# EAGLE schematic pmod-dual-bar-graph (EAGLE 7.4.0)
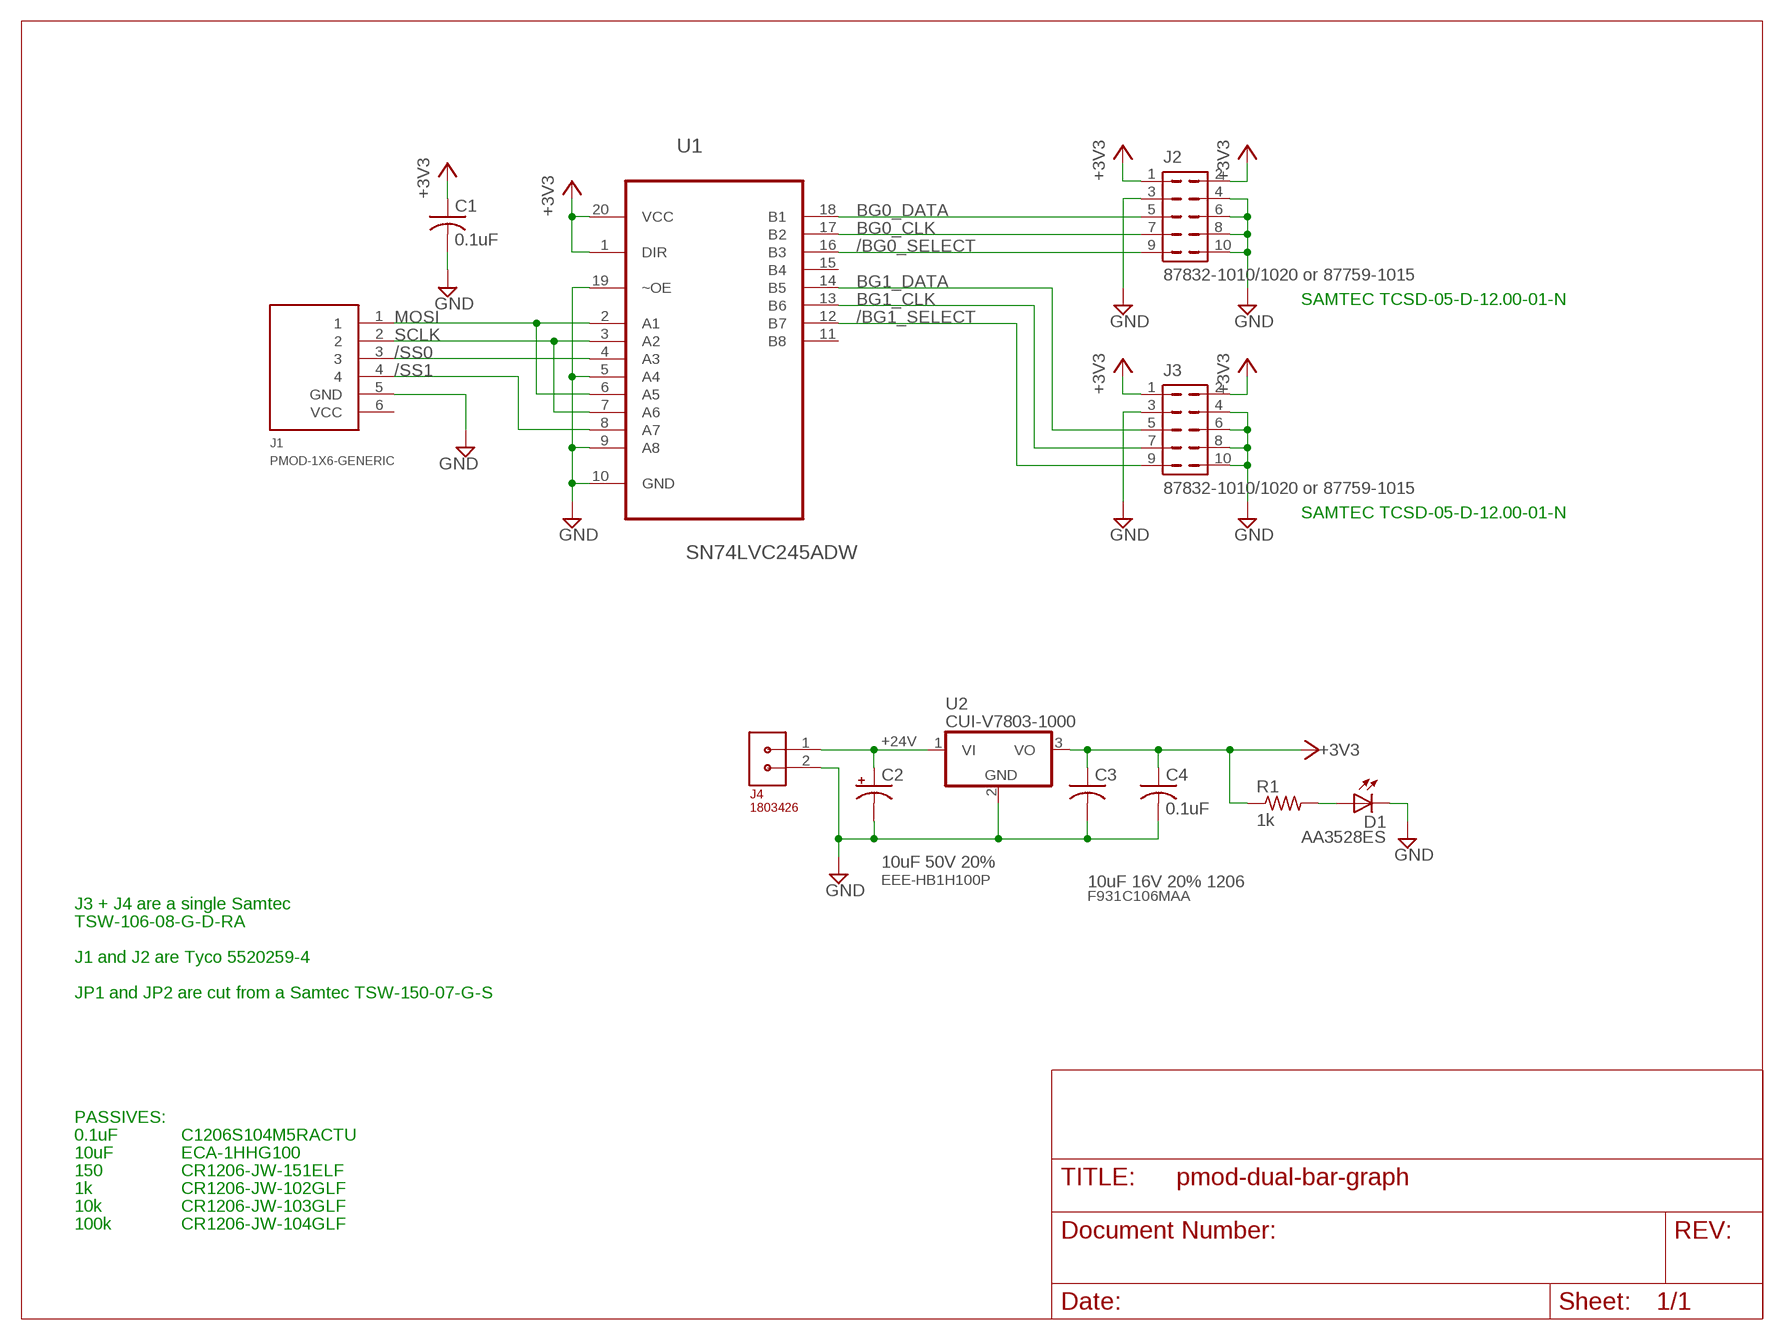
[diagram p0: schematic, sheet 1]

## Parts
C1  0.1uF  C-USC1206  [C1206]
C2  10uF 50V 20%  CPOL-USD  [PANASONIC_D]
C3  10uF 16V 20% 1206  C-USC1206  [C1206]
C4  0.1uF  C-USC1206  [C1206]
D1  AA3528ES  LEDKA-3528ASYC  [KA-3528ASYC]
J1  PMOD-1X6-GENERIC  [CON-PMOD-1X6]
J2  87832-1010/1020 or 87759-1015  87832-10  [87832-10]
J3  87832-1010/1020 or 87759-1015  87832-10  [87832-10]
J4  1803426  CON-3.81MM-1X2-PHOENIX-1803426  [CON-PHOENIX-1803426-3.81-1X2]
R1  1k  R-US_R1206  [R1206]
U1  SN74LVC245ADW  [SOIC127P1030X265-20N]
U2  CUI-V7803-1000  [CUI-78XX-1000]

## Nets
+3V3: C1.1 C3.1 C4.1 J2.1 J2.2 J3.1 J3.2 R1.1 U1.1(DIR) U1.20(VCC) U2.3(VO)
+24V: C2.+ J4.1 U2.1(VI)
/BG0_SELECT: J2.9 U1.16(B3)
/BG1_SELECT: J3.9 U1.12(B7)
/SS0: J1.3 U1.4(A3)
/SS1: J1.4 U1.8(A7)
BG0_CLK: J2.7 U1.17(B2)
BG0_DATA: J2.5 U1.18(B1)
BG1_CLK: J3.7 U1.13(B6)
BG1_DATA: J3.5 U1.14(B5)
GND: C1.2 C2.- C3.2 C4.2 D1.C J1.5(GND) J2.3 J2.4 J2.6 J2.8 J2.10 J3.3 J3.4 J3.6 J3.8 J3.10 J4.2 U1.5(A4) U1.9(A8) U1.10(GND) U1.19(~OE) U2.2(GND)
MOSI: J1.1 U1.2(A1) U1.6(A5)
N$31: D1.A R1.2
SCLK: J1.2 U1.3(A2) U1.7(A6)
Unconnected: J1.6(VCC) U1.11(B8) U1.15(B4)

## Notes on the sheet
- SAMTEC TCSD-05-D-12.00-01-N
- SAMTEC TCSD-05-D-12.00-01-N
- EEE-HB1H100P
- F931C106MAA
- J3 + J4 are a single Samtec
- TSW-106-08-G-D-RA
- J1 and J2 are Tyco 5520259-4
- JP1 and JP2 are cut from a Samtec TSW-150-07-G-S
- PASSIVES:
- 0.1uF | C1206S104M5RACTU
- 10uF | ECA-1HHG100
- 150 | CR1206-JW-151ELF
- 1k | CR1206-JW-102GLF
- 10k | CR1206-JW-103GLF
- 100k | CR1206-JW-104GLF

## Library data of the parts
C1 C3 C4 = rcl:C-US: CAPACITOR, American symbol
C2 = rcl:CPOL-US: POLARIZED CAPACITOR, American symbol
D1 = led:LED: LED OSRAM: - CHIPLED LG R971, LG N971, LY N971, LG Q971, LY Q971, LO R971, LY R971 LH N974, LH R974 LS Q976, LO Q976, LY Q976 LO Q996 - Hyper CHIPLED LW Q18S LB Q993, LB Q99A, LB R99A - SideLED LS A670, LO A670, LY A670, LG A670, LP A670 LB A673, LV A673, LT A673, LW A673 LH A674 LY A675 LS A676, LA A676, LO A676, LY A676, LW A676 LS A679, LY A679, LG A679 - Hyper Micro SIDELED® LS Y876, LA Y876, LO Y876, LY Y876 LT Y87S - SmartLED LW L88C, LW L88S LB L89C, LB L89S, LG L890 LS L89K, LO L89K, LY L89K LS L896, LA L896, LO L896, LY L896 - TOPLED LS T670, LO T670, LY T670, LG T670, LP T670 LSG T670, LSP T670, LSY T670, LOP T670, LYG T670 LG T671, LOG T671, LSG T671 LB T673, LV T673, LT T673, LW T673 LH T674 LS T676, LA T676, LO T676, LY T676, LB T676, LH T676, LSB T676, LW T676 LB T67C, LV T67C, LT T67C, LS T67K, LO T67K, LY T67K, LW E67C LS E67B, LA E67B, LO E67B, LY E67B, LB E67C, LV E67C, LT E67C LW T67C LS T679, LY T679, LG T679 LS T770, LO T770, LY T770, LG T770, LP T770 LB T773, LV T773, LT T773, LW T773 LH T774 LS E675, LA E675, LY E675, LS T675 LS T776, LA T776, LO T776, LY T776, LB T776 LHGB T686 LT T68C, LB T68C - Hyper Mini TOPLED® LB M676 - Mini TOPLED Santana® LG M470 LS M47K, LO M47K, LY M47K Source: http://www.osram.convergy.de LUXEON: - LUMILED® LXK2-PW12-R00, LXK2-PW12-S00, LXK2-PW14-U00, LXK2-PW14-V00 LXK2-PM12-R00, LXK2-PM12-S00, LXK2-PM14-U00 LXK2-PE12-Q00, LXK2-PE12-R00, LXK2-PE12-S00, LXK2-PE14-T00, LXK2-PE14-U00 LXK2-PB12-K00, LXK2-PB12-L00, LXK2-PB12-M00, LXK2-PB14-N00, LXK2-PB14-P00, LXK2-PB14-Q00 LXK2-PR12-L00, LXK2-PR12-M00, LXK2-PR14-Q00, LXK2-PR14-R00 LXK2-PD12-Q00, LXK2-PD12-R00, LXK2-PD12-S00 LXK2-PH12-R00, LXK2-PH12-S00 LXK2-PL12-P00, LXK2-PL12-Q00, LXK2-PL12-R00 Source: www.luxeon.com KINGBRIGHT: KA-3528ASYC Source: www.kingbright.com
J1 = 0GlenConnectors:PMOD-1X6-GENERIC
J2 J3 = con-molex:87832-10: Milli-Grid Header 2.00mm (.079") Pitch; OC_FARNELL: unknown; OC_NEWARK: unknown
J4 = 0GlenConnectors:CON-3.81MM-1X2-PHOENIX-1803426
R1 = rcl:R-US_: RESISTOR, American symbol
U1 = Texas Instruments_By_element14_Batch_1:SN74LVC245ADW: OCTAL BUS TRANSCEIVER WITH 3-STATE OUTPUTS; MPN: SN74LVC245ADW; OC_FARNELL: 1102983; OC_NEWARK: 76C4247; PACKAGE: SOIC-20; SUPPLIER: Texas Instruments
U2 = GlenPartsLibrary:CUI-V7803-1000